# Altium schematic sheet Power.SchDoc: {Наименование}
size 420 x 297 mm; ApprovedBy: {Утвердил}; CheckedBy: {Проверил}; DrawnBy: {Разраб.}; DocumentNumber: АБВГ 123456.789 00; SheetNumber: {}; SheetTotal: {}; Scale: {Мш.}; PageSetup: Record=PageOptions|CenterHorizontal=False|CenterVertical=False|PrintScale=0.95|XCorrection=0.00|YCorrection=0.00|PrintKind=1|BorderSize=5000000|LeftOffset=0|BottomOffset=0|Orientation=1|PaperLength=1000|PaperWidth=1000|Scale=100|PaperSource=15|PrintQuality=600|MediaType=1|DitherType=10|PaperKind=A4|PrintScaleMode=1; ProcessInspection: {Т.контр.}; Mass: {М.}; NormInspection: {Н.контр.}; Letter1Column: {}; Letter2Column: {}; Letter3Column: {}; DocumentType: {Документ}; Rule: PcbType=ProtelPcb
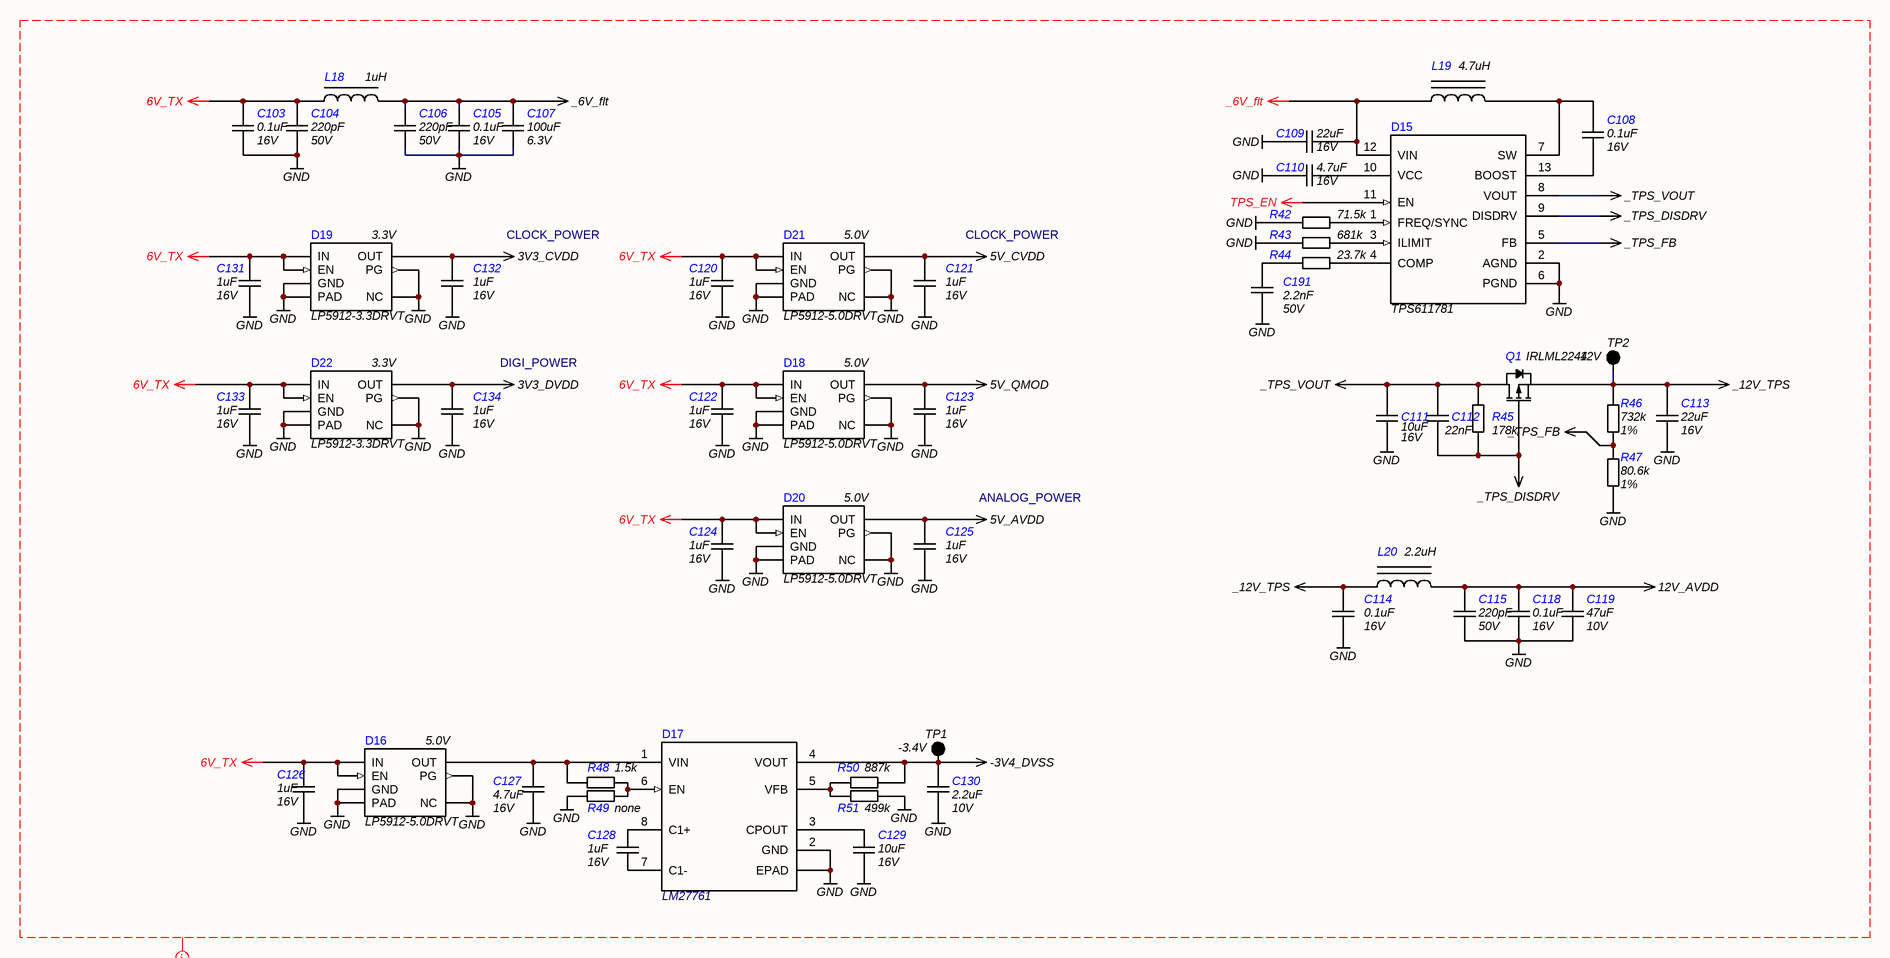
[diagram p0: Power.SchDoc]

## Parts
C103  value 0.1uF  Voltage: 16V  [C0402]  (hidden comment: CAP)
C104  value 220pF  Voltage: 50V  [C0603]  (hidden comment: CAP)
C105  value 0.1uF  Voltage: 16V  [C0402]  (hidden comment: CAP)
C106  value 220pF  Voltage: 50V  [C0603]  (hidden comment: CAP)
C107  value 100uF  Voltage: 6.3V  [C1210]  (hidden comment: CAP uF)
C108  value 0.1uF  Voltage: 16V  [C0402]  (hidden comment: CAP)
C109  value 22uF  Voltage: 16V  [C0805]  (hidden comment: CAP uF)
C110  value 4.7uF  Voltage: 16V  [C0603]  (hidden comment: CAP)
C111  value 10uF  Voltage: 16V  [C0805]  (hidden comment: CAP uF)
C112  value 22nF  [C0402]  (hidden comment: CAP)
C113  value 22uF  Voltage: 16V  [C0805]  (hidden comment: CAP uF)
C114  value 0.1uF  Voltage: 16V  [C0402]  (hidden comment: CAP)
C115  value 220pF  Voltage: 50V  [C0603]  (hidden comment: CAP)
C118  value 0.1uF  Voltage: 16V  [C0402]  (hidden comment: CAP)
C119  value 47uF  Voltage: 10V  [C1210]  (hidden comment: CAP uF)
C120  value 1uF  Voltage: 16V  [C0603]  (hidden comment: CAP)
C121  value 1uF  Voltage: 16V  [C0603]  (hidden comment: CAP)
C122  value 1uF  Voltage: 16V  [C0603]  (hidden comment: CAP)
C123  value 1uF  Voltage: 16V  [C0603]  (hidden comment: CAP)
C124  value 1uF  Voltage: 16V  [C0603]  (hidden comment: CAP)
C125  value 1uF  Voltage: 16V  [C0603]  (hidden comment: CAP)
C126  value 1uF  Voltage: 16V  [C0603]  (hidden comment: CAP)
C127  value 4.7uF  Voltage: 16V  [C0603]  (hidden comment: CAP)
C128  value 1uF  Voltage: 16V  [C0603]  (hidden comment: CAP)
C129  value 10uF  Voltage: 16V  [C0805]  (hidden comment: CAP uF)
C130  value 2.2uF  Voltage: 10V  [C0603]  (hidden comment: CAP)
C131  value 1uF  Voltage: 16V  [C0603]  (hidden comment: CAP)
C132  value 1uF  Voltage: 16V  [C0603]  (hidden comment: CAP)
C133  value 1uF  Voltage: 16V  [C0603]  (hidden comment: CAP)
C134  value 1uF  Voltage: 16V  [C0603]  (hidden comment: CAP)
C191  value 2.2nF  Voltage: 50V  [C0603]  (hidden comment: CAP)
D15  TPS611781  [TPS611781x]
D16  Name: LP5912-5.0DRVT  Voltage: 5.0V  [WSON-6]  (hidden comment: LP5912)
D17  LM27761  [WSON-8]
D18  Name: LP5912-5.0DRVT  Voltage: 5.0V  [WSON-6]  (hidden comment: LP5912)
D19  Name: LP5912-3.3DRVT  Voltage: 3.3V  [WSON-6]  (hidden comment: LP5912)
D20  Name: LP5912-5.0DRVT  Voltage: 5.0V  [WSON-6]  (hidden comment: LP5912)
D21  Name: LP5912-5.0DRVT  Voltage: 5.0V  [WSON-6]  (hidden comment: LP5912)
D22  Name: LP5912-3.3DRVT  Voltage: 3.3V  [WSON-6]  (hidden comment: LP5912)
L18  value 1uH  [L1210_Murata LQH]  (hidden comment: Inductor LF)
L19  value 4.7uH  [XAL4030]  (hidden comment: Inductor PWR)
L20  value 2.2uH  [XAL4020]  (hidden comment: Inductor PWR)
Q1  IRLML2244  [SOT-23]
R42  value 71.5k  [R0402]  (hidden comment: RES)
R43  value 681k  [R0402]  (hidden comment: RES)
R44  value 23.7k  [R0603]  (hidden comment: RES)
R45  value 178k  [R0402]  (hidden comment: RES)
R46  value 732k  Tolerance: 1%  [R0402]  (hidden comment: RES)
R47  value 80.6k  Tolerance: 1%  [R0402]  (hidden comment: RES)
R48  value 1.5k  [R0402]  (hidden comment: RES)
R49  value none  [R0402]  (hidden comment: RES)
R50  value 887k  [R0402]  (hidden comment: RES)
R51  value 499k  [R0402]  (hidden comment: RES)
TP1  -3.4V  [Control Point]
TP2  12V  [Control Point]

## Nets
3V3_CVDD: C132.1 D19.1(OUT)
3V3_DVDD: C134.1 D22.1(OUT)
5V_AVDD: C125.1 D20.1(OUT)
5V_CVDD: C121.1 D21.1(OUT)
5V_QMOD: C123.1 D18.1(OUT)
6V_TX: C103.2 C104.2 C120.1 C122.1 C124.1 C126.1 C131.1 C133.1 D16.4(EN) D16.6(IN) D18.4(EN) D18.6(IN) D19.4(EN) D19.6(IN) D20.4(EN) D20.6(IN) D21.4(EN) D21.6(IN) D22.4(EN) D22.6(IN) L18.1
12V_AVDD: C115.2 C118.2 C119.2 L20.2
-3V4_DVSS: C130.1 D17.4(VOUT) R50.2 TP1.1
_6V_flt: C105.2 C106.2 C107.2 C109.1 D15.12(VIN) L18.2 L19.1
_12V_TPS: C113.2 C114.2 L20.1 Q1.2(S) R46.2 TP2.1
_TPS_DISDRV: C112.2 D15.9(DISDRV) Q1.1(G) R45.1
_TPS_FB: D15.5(FB) R46.1 R47.2
_TPS_VOUT: C111.2 C112.1 D15.8(VOUT) Q1.3(D) R45.2
GND: C103.1 C104.1 C105.1 C106.1 C107.1 C109.2 C110.2 C111.1 C113.1 C114.1 C115.1 C118.1 C119.1 C120.2 C121.2 C122.2 C123.2 C124.2 C125.2 C126.2 C127.2 C129.2 C130.2 C131.2 C132.2 C133.2 C134.2 C191.1 D15.2(AGND) D15.6(PGND) D16.0(PAD) D16.2(NC) D16.3(PG) D16.5(GND) D17.0(EPAD) D17.2(GND) D18.0(PAD) D18.2(NC) D18.3(PG) D18.5(GND) D19.0(PAD) D19.2(NC) D19.3(PG) D19.5(GND) D20.0(PAD) D20.2(NC) D20.3(PG) D20.5(GND) D21.0(PAD) D21.2(NC) D21.3(PG) D21.5(GND) D22.0(PAD) D22.2(NC) D22.3(PG) D22.5(GND) R42.1 R43.1 R47.1 R49.1 R51.2
TPS_EN: D15.11(EN)
NetC108_1: C108.1 D15.13(BOOST)
NetC108_2: C108.2 D15.7(SW) L19.2
NetC110_1: C110.1 D15.10(VCC)
NetC127_1: C127.1 D16.1(OUT) D17.1(VIN) R48.2
NetC128_1: C128.1 D17.7(C1-)
NetC128_2: C128.2 D17.8(C1+)
NetC129_1: C129.1 D17.3(CPOUT)
NetC191_2: C191.2 R44.1
NetD15_1: D15.1(FREQ/SYNC) R42.2
NetD15_3: D15.3(ILIMIT) R43.2
NetD15_4: D15.4(COMP) R44.2
NetD17_5: D17.5(VFB) R50.1 R51.1
NetD17_6: D17.6(EN) R48.1 R49.2

## Layout directives
net class POWER: 3V3_CVDD, 3V3_DVDD, 5V_AVDD, 5V_CVDD, 5V_QMOD, 6V_TX, 12V_AVDD, -3V4_DVSS, _6V_flt, _12V_TPS, _TPS_DISDRV, _TPS_FB, _TPS_VOUT, GND, TPS_EN

## Notes on the sheet
- CLOCK_POWER
- (near C121) CLOCK_POWER
- DIGI_POWER
- ANALOG_POWER
- Перв. примен.
- Справ. №
- Подп. и дата
- Инв. № дубл.
- Взам. инв. №
- Изм.
- Лист
- № докум.
- Подп.
- Дата
- Лит.
- Масса
- Масштаб
- Т.контр.
- Пров.
- Разраб.
- Листов
- Инв. № подл.
- Н.контр.
- Утв.
- Копировал
- Формат А3

## Library data of the parts
C103 C105 C108 C114 C118 = CAP: SMD Capacitor; Manufacturer: Murata; Material: X7R; Tolerance: 10%; Type: Ceramic Capacitor; P/N: GRM155R71C104KA88J; Supplier 1: Digi-key; Supplier Part Number 1: 490-6328-1-ND; Supplier 2: Mouser; Supplier Part Number 2: 81-GRM155R71C104KA8J; Supplier 3: Farnell; Supplier Part Number 3: *
  C103 C105 C118: Parameter 1: *
C104 C106 C115 = CAP: SMD Capacitor; Manufacturer: Kemet; Material: X7R; Tolerance: 10%; Type: Ceramic Capacitor; P/N: C0603C221K5RACAUTO; Supplier 1: Digi-key; Supplier Part Number 1: 399-6869-1-ND; Supplier 2: Mouser; Supplier Part Number 2: 80-C0603C221K5RAUTO; Supplier 3: Farnell; Supplier Part Number 3: *
C107 = CAP uF: SMD Capacitor; Manufacturer: Murata; Material: X5R; Tolerance: 20%; Type: Ceramic Capacitor; P/N: GRM32ER60J107ME20L; Supplier 1: Digi-key; Supplier Part Number 1: 490-3390-1-ND; Supplier 2: Mouser; Supplier Part Number 2: 81-GRM32ER60J107ME20; Supplier 3: Farnell; Supplier Part Number 3: *
C109 C113 = CAP uF: SMD Capacitor; Manufacturer: Murata; Material: X5R; Tolerance: ±20%; Type: Ceramic Capacitor; P/N: GRM21BR61C226ME44L; Supplier 1: Digi-key; Supplier Part Number 1: 490-10747-1-ND; Supplier 2: Mouser; Supplier Part Number 2: 81-GRM21BR61C226ME4L; Supplier 3: Farnell; Supplier Part Number 3: *
C110 C127 = CAP: SMD Capacitor; Manufacturer: Samsung; Material: X5R; Tolerance: 10%; Type: Ceramic Capacitor; P/N: CL10A475KO8NNNC; Supplier 1: Digi-key; Supplier Part Number 1: 1276-1784-1-ND; Supplier 2: Mouser; Supplier Part Number 2: 187-CL10A475KO8NNNC; Supplier 3: Farnell; Supplier Part Number 3: 3013397
C111 C129 = CAP uF: SMD Capacitor; Manufacturer: Murata; Material: X5R; Tolerance: ±10%; Type: Ceramic Capacitor; P/N: GRM21BR61C106KE15K; Supplier 1: Digi-key; Supplier Part Number 1: 490-6473-1-ND; Supplier 2: Mouser; Supplier Part Number 2: 81-GRM21BR61C106KE5K; Supplier 3: Farnell; Supplier Part Number 3: *
C112 = CAP: SMD Capacitor; Manufacturer: Murata; Material: X7R; Tolerance: 10%; Voltage: 50V; Type: Ceramic Capacitor; P/N: GCM155R71H223KA55D; Supplier 1: Digi-key; Supplier Part Number 1: 490-4763-1-ND; Supplier 2: Mouser; Supplier Part Number 2: 81-GCM155R71H223KA5D; Supplier 3: Farnell; Supplier Part Number 3: *
C119 = CAP uF: SMD Capacitor; Manufacturer: Murata; Material: X7R; Tolerance: 10%; Type: Ceramic Capacitor; P/N: GRM32ER71A476KE15L; Supplier 1: Digi-key; Supplier Part Number 1: 490-5312-1-ND; Supplier 2: Mouser; Supplier Part Number 2: 81-GRM32ER71A476KE5L; Supplier 3: Farnell; Supplier Part Number 3: *
C120-C126 C128 C131-C134 = CAP: SMD Capacitor; Manufacturer: Kemet; Material: X7R; Tolerance: 10%; Type: Ceramic Capacitor; P/N: C0603C105K4RACTU; Supplier 1: Digi-key; Supplier Part Number 1: 399-C0603C105K4RAC7867CT-ND; Supplier 2: Mouser; Supplier Part Number 2: 80-C0603C105K4R; Supplier 3: Farnell; Supplier Part Number 3: *
C130 = CAP: SMD Capacitor; Manufacturer: Murata; Material: X7R; Tolerance: 10%; Type: Ceramic Capacitor; P/N: GRM188R71A225KE15J; Supplier 1: Digi-key; Supplier Part Number 1: 490-6418-1-ND; Supplier 2: Mouser; Supplier Part Number 2: 81-GRM188R71A225KE5J; Supplier 3: Farnell; Supplier Part Number 3: *
C191 = CAP: SMD Capacitor; Manufacturer: Murata; Material: NP0; Tolerance: ±5%; Type: Ceramic Capacitor; P/N: GRM1885C1H222JA01D; Supplier 1: Digi-key; Supplier Part Number 1: 490-1459-1-ND; Supplier 2: Mouser; Supplier Part Number 2: 81-GRM1885C1H222JA01; Supplier 3: Farnell; Supplier Part Number 3: *
D15 = TPS611781: 10-A Fully-Integrated Synchronous Boost with Load Disconnect Control; Manufacturer: Texas Instruments; Voltage: 4.5 V to 20 V; P/N: TPS611781RNW; Current: 10 A; Name: TPS611781; Package: 13-VQFN-HR (3.5x3.0); Temperature Range: –40°C to 125°C; Type: Synchronous Boost; Supplier 1: Digi-Key; Supplier Part Number 1: 296-48313-1-ND; Supplier 2: Mouser; Supplier Part Number 2: 595-TPS611781RNWR; Supplier 3: Farnell; Supplier Part Number 3: *
D16 D18-D22 = LP5912: LP5912 500-mA Low-Noise, Low-IQ LDO; Manufacturer: Texas Instruments; Type: Low-Noise LDO; Current: 500mA; Package: WSON; Temperature Range: –40°C to 125°C; Supplier 1: Digi-Key; Supplier 2: Mouser; Supplier 3: Farnell; Supplier Part Number 3: *
  D16 D18 D20 D21: P/N: LP5912-5.0DRVT; Supplier Part Number 1: 296-52224-1-ND; Supplier Part Number 2: 595-LP5912-5.0DRVT
  D19 D22: P/N: LP5912-3.3DRVT; Supplier Part Number 1: 296-44153-2-ND; Supplier Part Number 2: 595-LP5912-3.3DRVT
D17 = LM27761: Low-Noise, Regulated, Switched-Capacitor Voltage Inverter; Manufacturer: Texas Instruments; Voltage: 2.7 V to 5.5; P/N: LM27761DSGT; Current: 250 mA; Name: LM27761; Package: WSON; Temperature Range: –40°C to 125°C; Type: Voltage Inverter; Supplier 1: Digi-key; Supplier Part Number 1: 296-43882-1-ND; Supplier 2: Mouser; Supplier Part Number 2: 595-LM27761DSGT; Supplier 3: Farnell; Supplier Part Number 3: *
L18 = Inductor LF: Inductor Power Lines; Manufacturer: Murata; Name: LQH32PN1R0NNC; Current: 2500mA; Tolerance: 5%; Frequency: 100MHz; Temperature Range: -25ºC to 85ºC; Series: LQH; P/N: LQH32PN1R0NNC; Supplier 1: Digi-key; Supplier Part Number 1: 490-12035-1-ND; Supplier 2: Mouser; Supplier Part Number 2: 81-LQH32PN1R0NNCL; Supplier 3: Farnell; Supplier Part Number 3: *
L19 = Inductor PWR: Magnetic-Core Inductor; Manufacturer: Coilcraft; Name: XEL4030-472MEB; Current: 5A; Tolerance: ±30%; Temperature Range: -40ºC to 125ºC; Supplier 1: Digi-key; Supplier Part Number 1: *; Supplier 2: Mouser; Supplier Part Number 2: 994-XEL4030-472MEC; Supplier 3: Farnell; Supplier Part Number 3: 2836831
L20 = Inductor PWR: Magnetic-Core Inductor; Manufacturer: Coilcraft; Name: XEL4020-222MEC; Current: 5.9A; Tolerance: ±30%; Temperature Range: -40ºC to 125ºC; P/N: XEL4020-222MEC; Supplier 2: Mouser; Supplier Part Number 2: 994-XEL4020-222MEC; Supplier 3: Farnell; Supplier Part Number 3: 2836818; Supplier 1: Digi-key; Supplier Part Number 1: *
Q1 = IRLML2244: P-Channel MOSFET; Current: 4.3A; Channel Resistance: 54 mΩ; Power Dissipation: 1.3W; Voltage: -20V; P/N: IRLML2244TRPBF; Name: IRLML2244; Package: SOT-23; Type: P-Channel Mosfet; Value: IRLML2244; Supplier 1: Digi-key; Supplier Part Number 1: IRLML2244TRPBFCT-ND; Supplier 2: Mouser; Supplier Part Number 2: 942-IRLML2244TRPBF; Supplier 3: Farnell; Supplier Part Number 3: *
R42 = RES: SMD Resistor; Manufacturer: Panasonic Electronic Components; Name: Chip SMD Resistor; Power: 0.063 Wt; Tolerance: 1%; P/N: ERJ-2RKF7152X; Temperature Range: -55…155°C; Supplier 1: Digi-key; Supplier Part Number 1: P71.5KLCT-ND; Supplier 2: Mouser; Supplier Part Number 2: 667-ERJ-2RKF7152X; Supplier 3: Farnell; Supplier Part Number 3: *
R43 = RES: SMD Resistor; Manufacturer: Panasonic Electronic Components; Name: Chip SMD Resistor; Power: 0.063 Wt; Tolerance: 1%; P/N: ERJ-2RKF6813X; Temperature Range: -55…155°C; Supplier 1: Digi-key; Supplier Part Number 1: P681KLCT-ND; Supplier 2: Mouser; Supplier Part Number 2: 667-ERJ-2RKF6813X; Supplier 3: Farnell; Supplier Part Number 3: *
R44 = RES: SMD Resistor; Manufacturer: Panasonic Electronic Components; Name: Chip SMD Resistor; Power: 0.1 Wt; Tolerance: 1%; P/N: ERJ-3EKF2372V; Temperature Range: -55…155°C; Supplier 1: Digi-key; Supplier Part Number 1: P23.7KHCT-ND; Supplier 2: Mouser; Supplier Part Number 2: 667-ERJ-3EKF2372V; Supplier 3: Farnell; Supplier Part Number 3: *
R45 = RES: SMD Resistor; Manufacturer: Panasonic Electronic Components; Name: Chip SMD Resistor; Power: 0.063 Wt; Tolerance: 1%; P/N: ERJ-2RKF1783X; Temperature Range: -55…155°C; Supplier 1: Digi-key; Supplier Part Number 1: P178KLCT-ND; Supplier 2: Mouser; Supplier Part Number 2: 667-ERJ-2RKF1783X; Supplier 3: Farnell; Supplier Part Number 3: *
R46 = RES: SMD Resistor; Manufacturer: Panasonic Electronic Components; Name: Chip SMD Resistor; Power: 0.063 Wt; P/N: ERJ-2RKF7323X; Temperature Range: -55…155°C; Supplier 1: Digi-key; Supplier Part Number 1: P732KLCT-ND; Supplier 2: Mouser; Supplier Part Number 2: 667-ERJ-2RKF7323X; Supplier 3: Farnell; Supplier Part Number 3: *
R47 = RES: SMD Resistor; Manufacturer: Panasonic Electronic Components; Name: Chip SMD Resistor; Power: 0.063 Wt; P/N: ERJ-2RKF8062X; Temperature Range: -55…155°C; Supplier 1: Digi-key; Supplier Part Number 1: P80.6KLCT-ND; Supplier 2: Mouser; Supplier Part Number 2: 667-ERJ-2RKF8062X; Supplier 3: Farnell; Supplier Part Number 3: *
R48 = RES: SMD Resistor; Manufacturer: Panasonic Electronic Components; Name: Chip SMD Resistor; Power: 0.063 Wt; Tolerance: 0.5%; P/N: ERJ-2RHD1501X; Temperature Range: -55…155°C; Supplier 1: Digi-key; 1: *; Supplier 2: Mouser; Supplier Part Number 2: 667-ERJ-2RHD1501X; Supplier 3: Farnell; Supplier Part Number 3: 2379819
R49 = RES: SMD Resistor; Name: Chip SMD Resistor; Power: 0.1 Wt; Tolerance: 1%; P/N: ERJ-2GE0R00X; Temperature Range: -55…155°C; Supplier 4: Digi-key; Supplier Part Number 4: P0.0JCT-ND; Supplier 5: Mouser; Supplier Part Number 5: 667-ERJ-2GE0R00X; Supplier 6: Farnell; Supplier Part Number 6: *
R50 = RES: SMD Resistor; Manufacturer: Panasonic Electronic Components; Name: Chip SMD Resistor; Power: 0.1 Wt; Tolerance: ±1%; P/N: ERJ-2RKF8873X; Temperature Range: -55…155°C; Supplier 1: Digi-key; Supplier Part Number 1: P887KLCT-ND; Supplier 2: Mouser; Supplier Part Number 2: 667-ERJ-2RKF8873X; Supplier 3: Farnell; Supplier Part Number 3: *
R51 = RES: SMD Resistor; Manufacturer: Panasonic Electronic Components; Name: Chip SMD Resistor; Power: 0.1 Wt; Tolerance: ±1%; P/N: ERJ-2RKF4993X; Temperature Range: -55…155°C; Supplier 1: Digi-key; Supplier Part Number 1: P499KLCT-ND; Supplier 2: Mouser; Supplier Part Number 2: 667-ERJ-2RKF4993X; Supplier 3: Farnell; Supplier Part Number 3: *
TP1 TP2 = Test  Point: Supplier 4: Digi-key; Supplier Part Number 4: *; Supplier 5: Mouser; Supplier Part Number 5: *; Supplier 6: Farnell; Supplier Part Number 6: *